# Altium schematic sheet Indicators.SchDoc
size A4; SheetNumber: 5; SheetTotal: 11
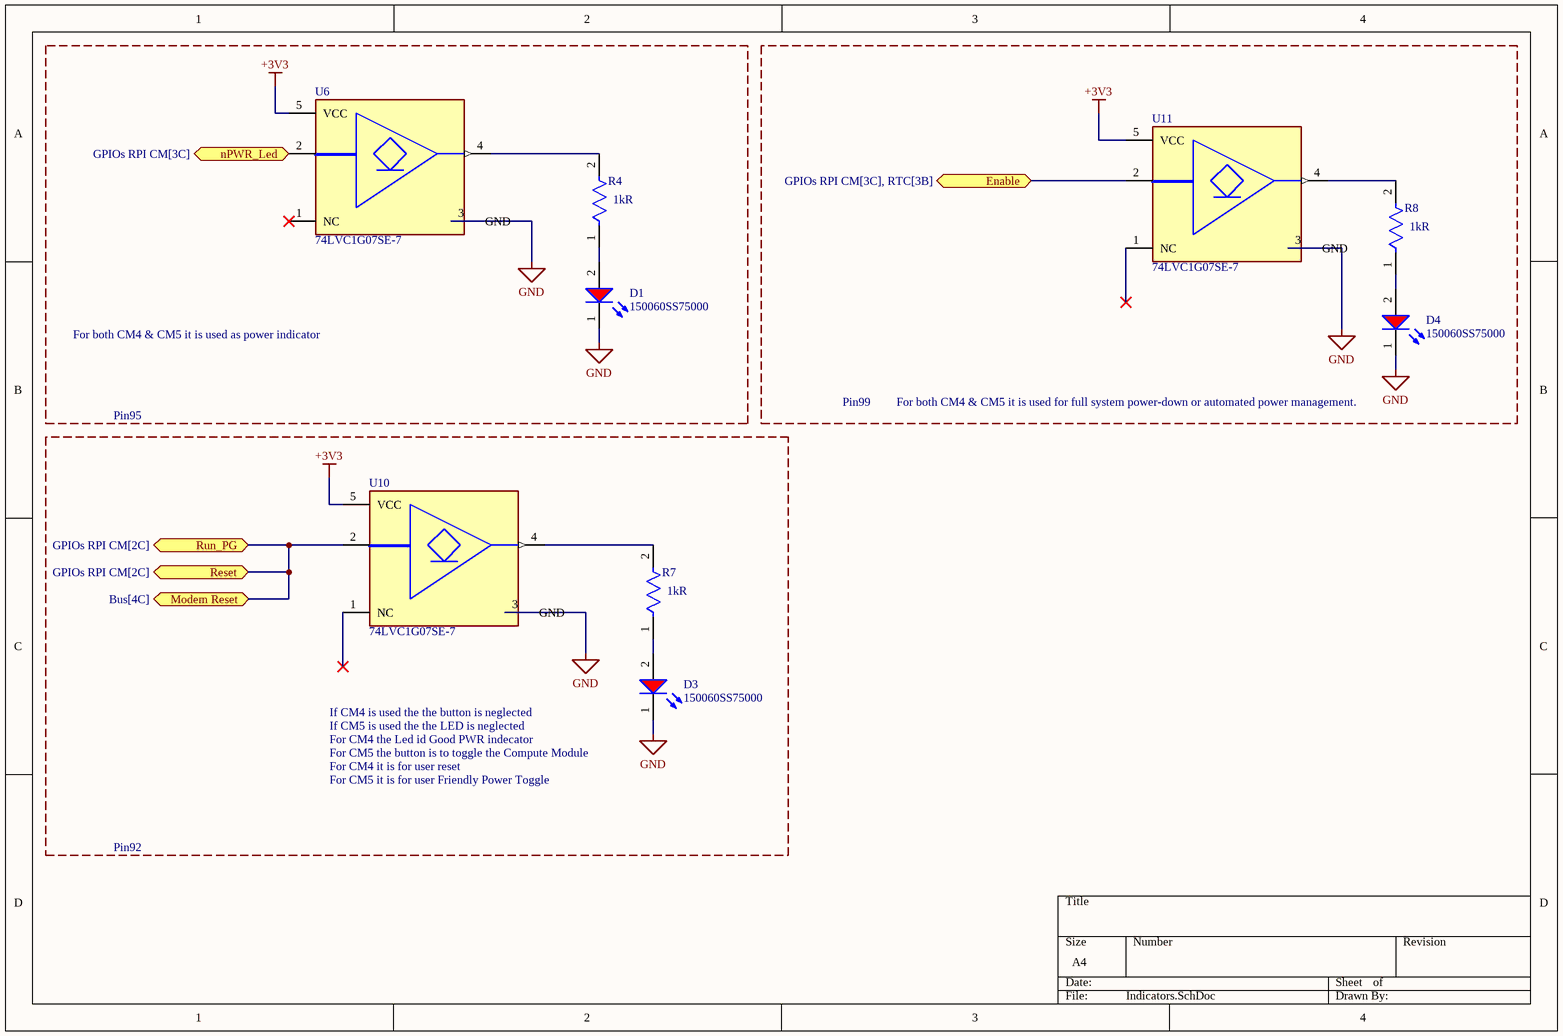
[diagram p0: Indicators.SchDoc]

## Parts
D1  150060SS75000  [WL-SMCW_0603_150060xx75000]
D3  150060SS75000  [WL-SMCW_0603_150060xx75000]
D4  150060SS75000  [WL-SMCW_0603_150060xx75000]
R4  Resistance: 1kR  [FP-ERA3A-IPC_C]  (hidden comment: ERA-3AEB102V)
R7  Resistance: 1kR  [FP-ERA3A-IPC_C]  (hidden comment: ERA-3AEB102V)
R8  Resistance: 1kR  [FP-ERA3A-IPC_C]  (hidden comment: ERA-3AEB102V)
U6  74LVC1G07SE-7  [FP-SOT353-MFG]
U10  74LVC1G07SE-7  [FP-SOT353-MFG]
U11  74LVC1G07SE-7  [FP-SOT353-MFG]

## Blocks framed on the sheet
Pin99: D4 R8 U11

## Ports
Enable (bidir, see GPIOs RPI CM[3C], RTC[3B]), Modem Reset (bidir, see Bus[4C]), nPWR_Led (bidir, see GPIOs RPI CM[3C]), Reset (bidir, see GPIOs RPI CM[2C]), Run_PG (bidir, see GPIOs RPI CM[2C])

## Nets
+3V3: U6.5(VCC) U10.5(VCC) U11.5(VCC)
GND: D1.1(K) D3.1(K) D4.1(K) U6.3(GND) U10.3(GND) U11.3(GND)
Enable: U11.2(A) ; port Enable
Modem Reset: U10.2(A) ; port Run_PG, port Reset, port Modem Reset
nPWR_Led: U6.2(A) ; port nPWR_Led
NetD1_2: D1.2(A) R4.1
NetD3_2: D3.2(A) R7.1
NetD4_2: D4.2(A) R8.1
NetR4_2: R4.2 U6.4(Y)
NetR7_2: R7.2 U10.4(Y)
NetR8_2: R8.2 U11.4(Y)

Not connected (* = marked no-connect by the designer): U6 1(NC)*; U10 1(NC)*; U11 1(NC)*

## Notes on the sheet
- For both CM4 & CM5 it is used as power indicator
- Pin95
- For both CM4 & CM5 it is used for full system power-down or automated power management.
- If CM4 is used the the button is neglected
- For CM4 the Led id Good PWR indecator
- If CM5 is used the the LED is neglected
- For CM5 the button is to toggle the Compute Module
- For CM5 it is for user Friendly Power Toggle
- For CM4 it is for user reset
- Pin92

## Library data of the parts
D1 D3 D4 = CMP-1426-00004-3: Led, Red, 630 Nm, 1.9 V, 30 Ma, 60 Mcd Rohs Compliant: Yes; Dominant Wavelength: 630nm; Lens Style: Clear, Rectangular; Forward Current: 100mA; Test Current: 20mA; Viewing Angle: 140°; Forward Voltage: 1.9V; Peak Wavelength: 645nm; Max Reverse Voltage (DC): 5V; Luminous Intensity: 60mcd; Color: Red; Height: 700µm; Min Operating Temperature: -40°C; Case Code (Imperial): 0603; REACH SVHC: Unknown; RoHS: Compliant; Length: 1.6mm; Case Code (Metric): 1608; Mount: Surface Mount; Wavelength: 630nm; Packaging: Tape and Reel; Max Operating Temperature: 85°C; Width: 800µm; Case/Package: 0603
R4 R7 R8 = CMP-2000-00873-2: RES SMD 1K OHM 0.1% 1/10W 0603; Temperature Coefficient: 25ppm/°C; Voltage Rating: 75V; Max Power Dissipation: 100mW; Technology: METAL FILM; Number of Pins: 2; Packaging: Tape and Reel; Case Code (Imperial): 0603; Case Code (Metric): 1608; Min Operating Temperature: -55°C; REACH SVHC: No SVHC; Length: 1.6mm; Termination: SMD/SMT; Depth: 0.8mm; Resistance Tolerance: 0.1%; Number of Terminations: 2; Width: 0.8mm; Military Standard: Not; Tolerance: 0.1%; Package Quantity: 5000; Contact Plating: Tin; Height: 0.45mm; Construction: Rectangular; Case/Package: 0603; Max Operating Temperature: 155°C; Resistor Type: Thin Film; Series: ERA-3A; Size Code: 0603; RoHS Compliant: Yes; Mount: Surface Mount; Radiation Hardening: No; Power Rating: 100mW
U6 U10 U11 = CMP-12739-000001-1: IC BUF NON-INVERT 5.5V SOT353; Manufacturer: Diodes Inc.; Number Of Outputs: 1; Standoff Height: 0mm; Propagation Delay: 1.7ns; Nominal Supply Current: 0.1uA; Min Supply Voltage: 1.65V; Max Junction Temp: +150°C; Logic Function Desc: Non-Inverting; Temperature: -40°C to +125°C; RoHS: TRUE; ComponentLink2Description: Datasheet; Category: IC; Ipc Land Pattern Name: SOT65P210X100-5; Digikey Description: IC BUF NON-INVERT 5.5V SOT353; Device Class L2: Logic ICs; Number Of Inputs: 1; Height: 1.1mm; Ambient Temperature Range High: +125°C; Lead Free: Yes; Octopart: https://octopart.com/74lvc1g07se-7-diodes+inc.-18882698; Device Class L1: Integrated Circuits (ICs); Number Of Circuits: 1; Max Supply Voltage: 5.5V; Temperature Range Low: -40°C; Manufacturer Part Number: 74LVC1G07SE-7; Device Class L3: Buffers; ComponentLink2URL: https://www.diodes.com/assets/Datasheets/74LVC1G07.pdf; Footprint Url: https://www.diodes.com/assets/Package-Files/SOT353.pdf; Temperature Range High: +125°C; Package: SOT353; Mouser Description: 74LVC Series 5.5 V Surface Mount Single Buffer with Open Drain Output - SOT-353; Automotive: No; Ambient Temperature Range Low: -40°C